# Altium schematic sheet TOP_MULTI.SchDoc
size A; SheetNumber: 1; SheetTotal: 2
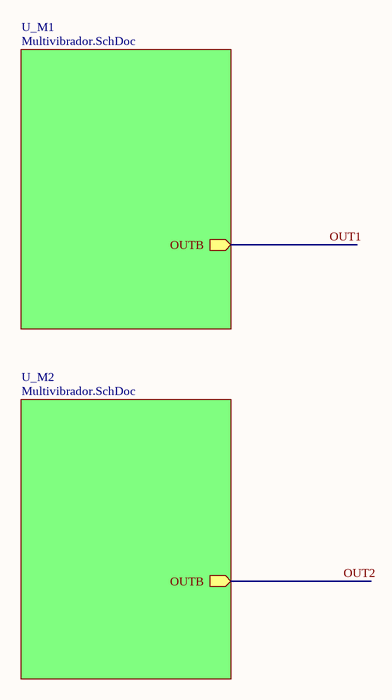
[diagram p0: TOP_MULTI.SchDoc]

## Sub-sheets
U_M1 = Multivibrador.SchDoc: OUTB (out)
U_M2 = Multivibrador.SchDoc: OUTB (out)

## Nets
OUT1: sheet U_M1/OUTB
OUT2: sheet U_M2/OUTB